# Altium project DT01.PrjPCB
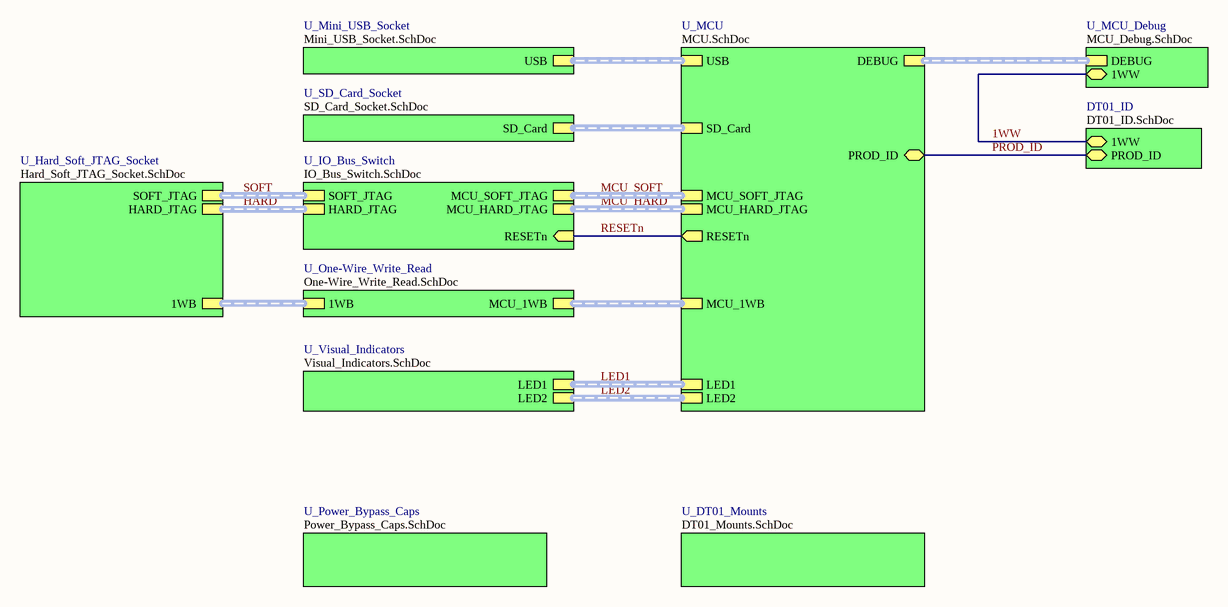
[diagram p0: DT01_Top.SchDoc]
ProjectAddress1: L3, 12A Rodborough Road; ProjectAddress2: Frenchs Forest; ProjectAddress3: NSW 2086; ProjectAddress4: Australia; ProjectAssyNum: D-820-0014; ProjectOrganization: Altium Limited; ProjectRevision: 01; ProjectTitle: DT01 - USB JTAG Interface; sheetTotal: 12
12 sheets, 94 parts. Net scope: hierarchical (ports join the sheet entries above them; power ports are global).
Board file: DT01.PcbDoc
Sheets:
  DT01_Top.SchDoc
    U_MCU = MCU.SchDoc
    DT01_ID = DT01_ID.SchDoc
    U_DT01_Mounts = DT01_Mounts.SchDoc
    U_Hard_Soft_JTAG_Socket = Hard_Soft_JTAG_Socket.SchDoc
    U_IO_Bus_Switch = IO_Bus_Switch.SchDoc
    U_Mini_USB_Socket = Mini_USB_Socket.SchDoc
    U_One-Wire_Write_Read = One-Wire_Write_Read.SchDoc
    U_Power_Bypass_Caps = Power_Bypass_Caps.SchDoc
    U_SD_Card_Socket = SD_Card_Socket.SchDoc
    U_Visual_Indicators = Visual_Indicators.SchDoc
    U_MCU_Debug = MCU_Debug.SchDoc

## Sheet DT01_Top.SchDoc: DT01 - USB JTAG Interface
size A4; Organization: Altium Limited.; Address1: Level 3, 12a Rodborough Rd; Address2: Frenchs Forest 2086; Address3: NSW; Address4: AUSTRALIA; DocumentNumber: 1; Revision: 01; SheetNumber: 1; SheetTotal: 12; PageSetup: Record=PageOptions|CenterHorizontal=True|CenterVertical=True|PrintScale=0.50|XCorrection=1.00|YCorrection=1.00|PrintKind=0|BorderSize=5000000|LeftOffset=0|BottomOffset=0|Orientation=2|PaperLength=1000|PaperWidth=1000|Scale=100|PaperSource=7|PrintQuality=600|MediaType=1|DitherType=10|PaperKind=A3 (297 x 420 mm)|PrintScaleMode=1

### Sub-sheets
DT01_ID = DT01_ID.SchDoc: PROD_ID (bidir), 1WW (bidir)
U_DT01_Mounts = DT01_Mounts.SchDoc: no entries
U_Hard_Soft_JTAG_Socket = Hard_Soft_JTAG_Socket.SchDoc: 1WB (harness 1WB_Write_Read), SOFT_JTAG (harness JTAG), HARD_JTAG (harness JTAG)
U_IO_Bus_Switch = IO_Bus_Switch.SchDoc: SOFT_JTAG (harness JTAG), HARD_JTAG (harness JTAG), MCU_SOFT_JTAG (harness JTAG), MCU_HARD_JTAG (harness JTAG), RESETn (in)
U_MCU = MCU.SchDoc: USB (harness USB), RESETn (out), DEBUG (harness LOCAL_JTAG), MCU_SOFT_JTAG (harness JTAG), MCU_HARD_JTAG (harness JTAG), MCU_1WB (harness MCU_1WB_R_W), LED1 (harness RGB_LED), LED2 (harness RGB_LED), PROD_ID (bidir), SD_Card (harness SD Card)
U_MCU_Debug = MCU_Debug.SchDoc: DEBUG (harness LOCAL_JTAG), 1WW (bidir)
U_Mini_USB_Socket = Mini_USB_Socket.SchDoc: USB (harness USB)
U_One-Wire_Write_Read = One-Wire_Write_Read.SchDoc: 1WB (harness 1WB_Write_Read), MCU_1WB (harness MCU_1WB_R_W)
U_Power_Bypass_Caps = Power_Bypass_Caps.SchDoc: no entries
U_SD_Card_Socket = SD_Card_Socket.SchDoc: SD_Card (harness SD Card)
U_Visual_Indicators = Visual_Indicators.SchDoc: LED1 (harness RGB_LED), LED2 (harness RGB_LED)

### Nets
1WW: sheet DT01_ID/1WW, sheet U_MCU_Debug/1WW
PROD_ID: sheet U_MCU/PROD_ID, sheet DT01_ID/PROD_ID
RESETn: sheet U_MCU/RESETn, sheet U_IO_Bus_Switch/RESETn

### Buses and harness runs
harness HARD = sheet U_Hard_Soft_JTAG_Socket/HARD_JTAG = sheet U_IO_Bus_Switch/HARD_JTAG
harness LED1 = sheet U_MCU/LED1 = sheet U_Visual_Indicators/LED1
harness LED2 = sheet U_MCU/LED2 = sheet U_Visual_Indicators/LED2
harness MCU_HARD = sheet U_IO_Bus_Switch/MCU_HARD_JTAG = sheet U_MCU/MCU_HARD_JTAG
harness MCU_SOFT = sheet U_IO_Bus_Switch/MCU_SOFT_JTAG = sheet U_MCU/MCU_SOFT_JTAG
harness sheet U_Hard_Soft_JTAG_Socket/1WB = sheet U_One-Wire_Write_Read/1WB
harness sheet U_MCU/DEBUG = sheet U_MCU_Debug/DEBUG
harness sheet U_MCU/MCU_1WB = sheet U_One-Wire_Write_Read/MCU_1WB
harness sheet U_MCU/SD_Card = sheet U_SD_Card_Socket/SD_Card
harness sheet U_MCU/USB = sheet U_Mini_USB_Socket/USB
harness SOFT = sheet U_Hard_Soft_JTAG_Socket/SOFT_JTAG = sheet U_IO_Bus_Switch/SOFT_JTAG

### Notes on the sheet
- Sheet Title
- Project Title
- Size:
- Date:
- A4
- Assy:
- Time:
- Revision:
- Sheet
- of
- File:

## Sheet MCU.SchDoc: MCU w/ USB & SDRAM Interface
size A2; DocumentNumber: 6; SheetNumber: 6; SheetTotal: 12
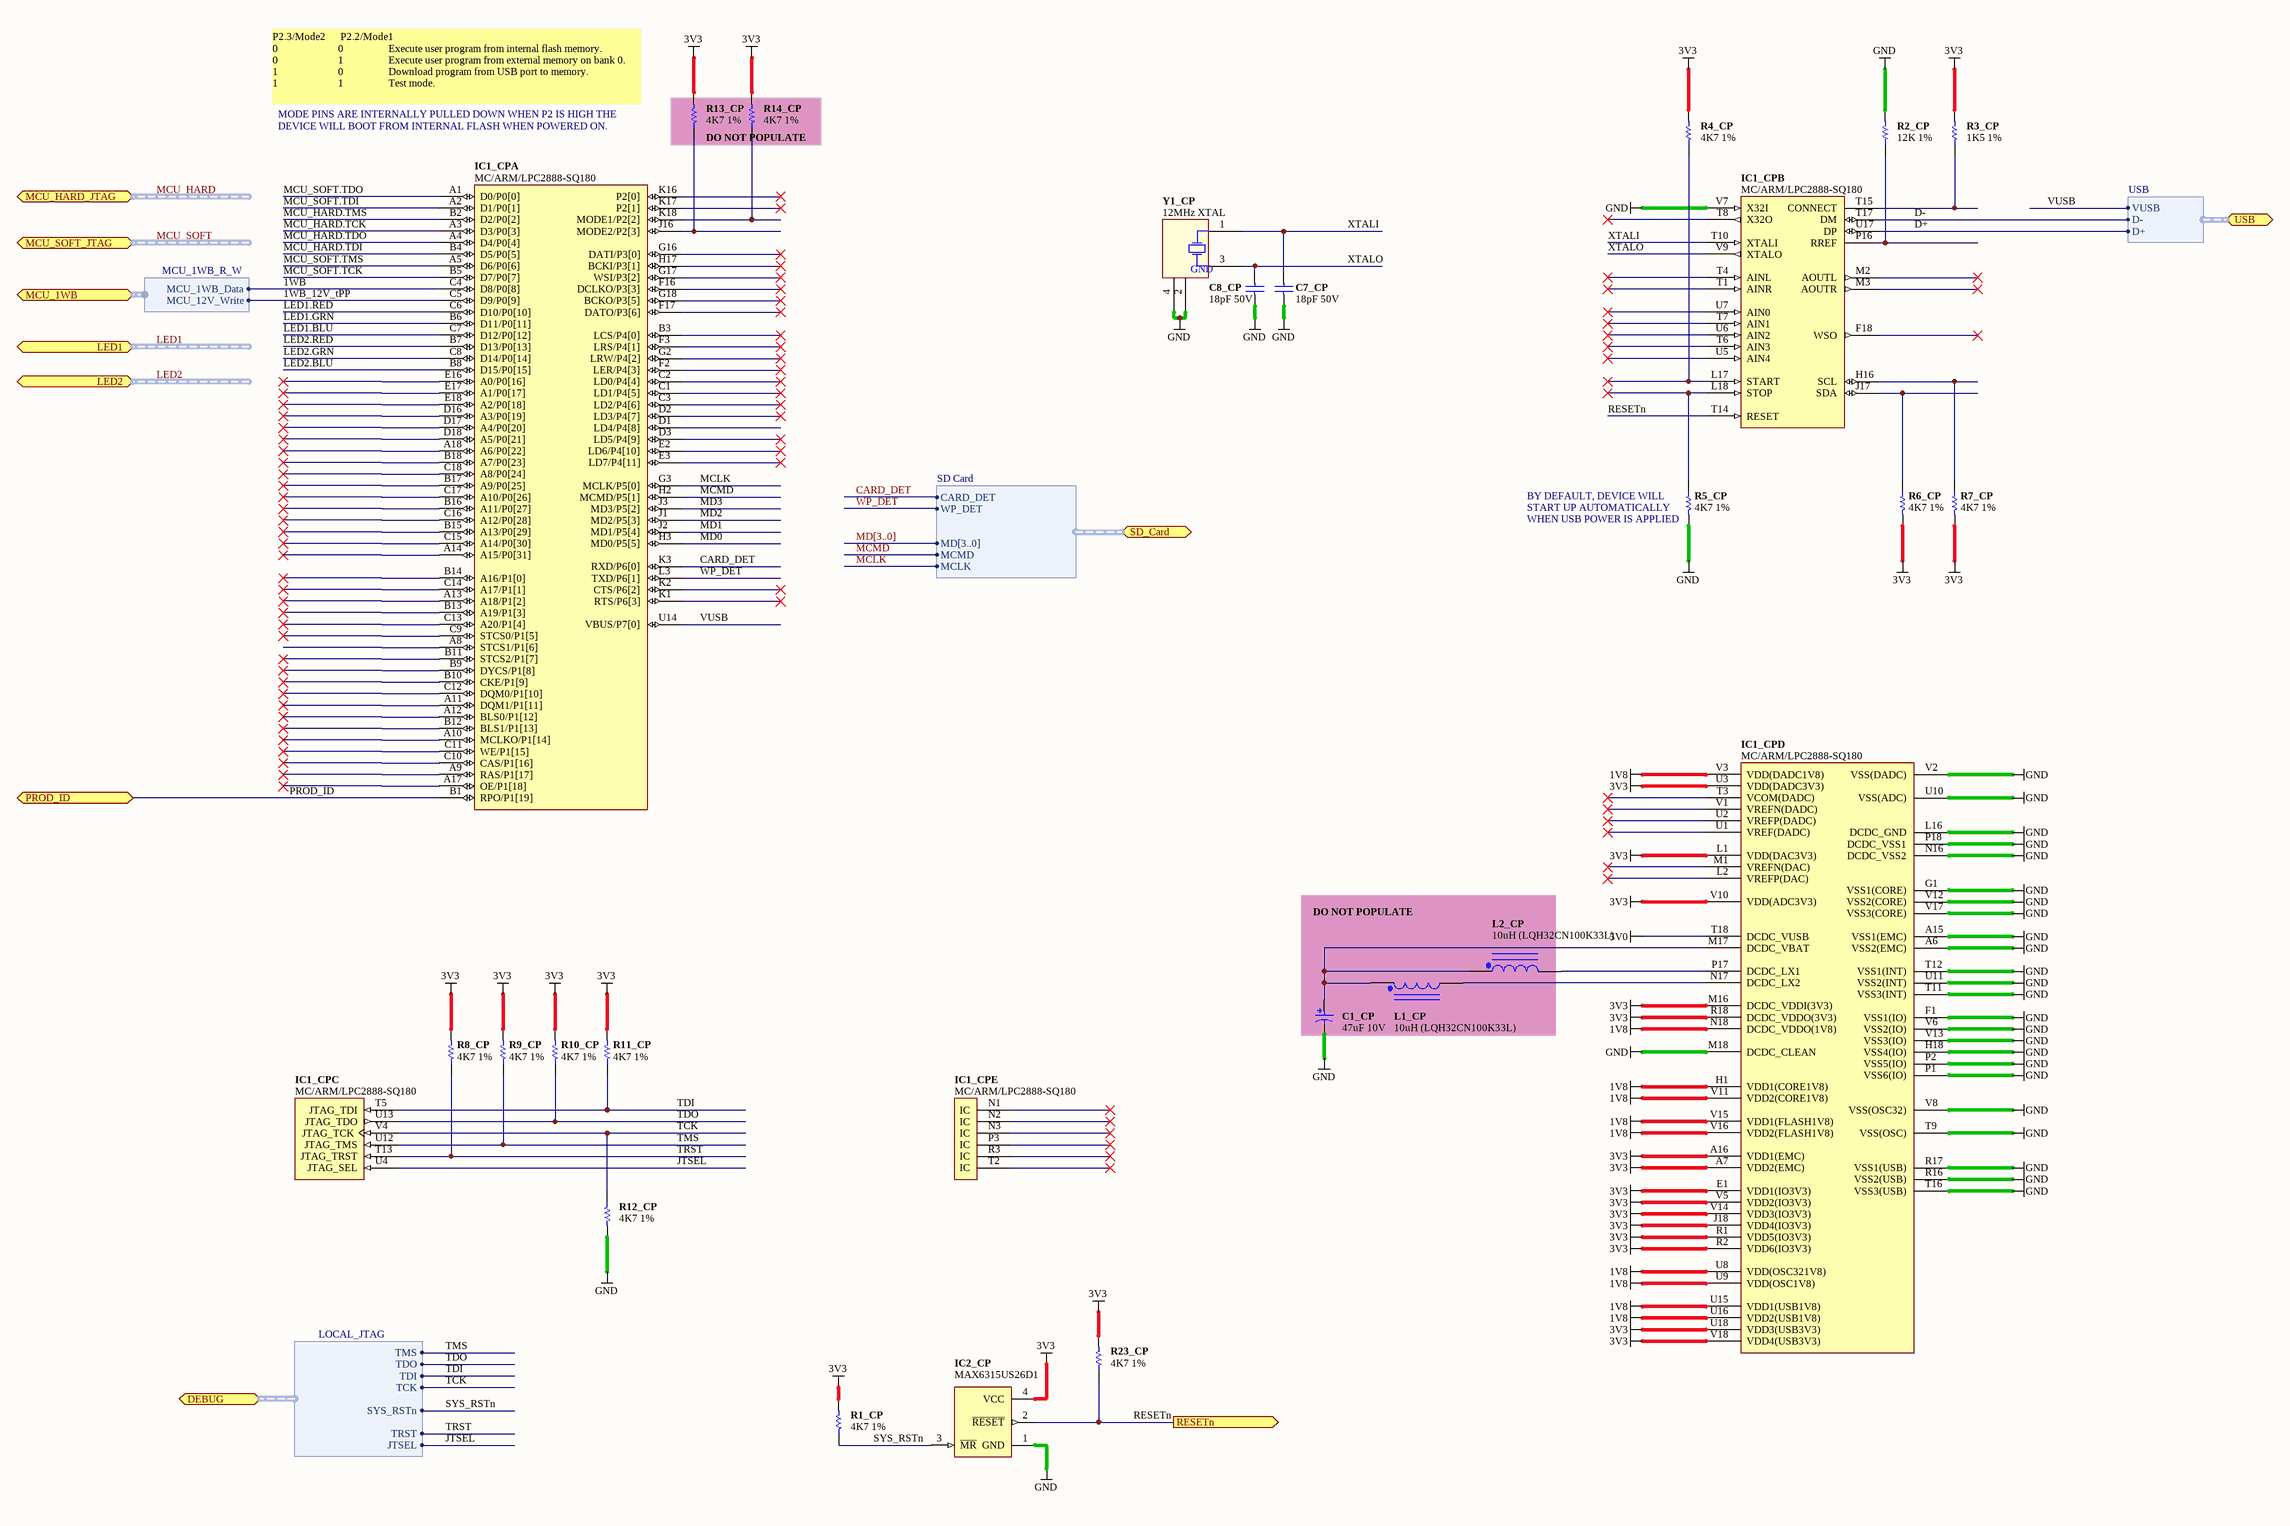
[diagram p1: MCU.SchDoc]

### Parts
C1_CP  47uF 10V  [CAPC3528-STAR]  (no BOM)
C7_CP  18pF 50V  [CAPC1005-STAR]
C8_CP  18pF 50V  [CAPC1005-STAR]
IC1_CP  MC/ARM/LPC2888-SQ180  [BGA50P18X18-180]  (parts A,B,C,D,E of 5)
IC2_CP  MAX6315US26D1  [SOT143]
L1_CP  10uH (LQH32CN100K33L)  [3261]  (no BOM)
L2_CP  10uH (LQH32CN100K33L)  [3261]  (no BOM)
R1_CP  4K7 1%  [RESC1005-STAR]
R2_CP  12K 1%  [RESC1005-STAR]
R3_CP  1K5 1%  [RESC1005-STAR]
R4_CP  4K7 1%  [RESC1005-STAR]
R5_CP  4K7 1%  [RESC1005-STAR]
R6_CP  4K7 1%  [RESC1005-STAR]
R7_CP  4K7 1%  [RESC1005-STAR]
R8_CP  4K7 1%  [RESC1005-STAR]
R9_CP  4K7 1%  [RESC1005-STAR]
R10_CP  4K7 1%  [RESC1005-STAR]
R11_CP  4K7 1%  [RESC1005-STAR]
R12_CP  4K7 1%  [RESC1005-STAR]
R13_CP  4K7 1%  [RESC1005-STAR]  (no BOM)
R14_CP  4K7 1%  [RESC1005-STAR]  (no BOM)
R23_CP  4K7 1%  [RESC1005-STAR]
Y1_CP  12MHz XTAL  [XTAL-200X126-4]

### Blocks framed on the sheet
DO NOT POPULATE: R13_CP R14_CP
DO NOT POPULATE: C1_CP L1_CP L2_CP

### Ports
DEBUG (harness LOCAL_JTAG), LED1 (harness RGB_LED), LED2 (harness RGB_LED), MCU_1WB (harness MCU_1WB_R_W), MCU_HARD_JTAG (harness JTAG), MCU_SOFT_JTAG (harness JTAG), PROD_ID (bidir), RESETn (out), SD_Card (harness SD Card), USB (harness USB)

### Harnesses
USB: VUSB, D-, D+
LOCAL_JTAG: TMS, TDO, TDI, TCK, SYS_RSTn, TRST, JTSEL
MCU_1WB_R_W: MCU_1WB_Data, MCU_12V_Write
SD Card: CARD_DET, WP_DET, MD[3..0], MCLK, MCMD

### Nets
1V8: IC1_CP.H1(VDD1(CORE1V8)) IC1_CP.N18(DCDC_VDDO(1V8)) IC1_CP.U8(VDD(OSC321V8)) IC1_CP.U9(VDD(OSC1V8)) IC1_CP.U15(VDD1(USB1V8)) IC1_CP.U16(VDD2(USB1V8)) IC1_CP.V3(VDD(DADC1V8)) IC1_CP.V11(VDD2(CORE1V8)) IC1_CP.V15(VDD1(FLASH1V8)) IC1_CP.V16(VDD2(FLASH1V8))
3V3: IC1_CP.A7(VDD2(EMC)) IC1_CP.A16(VDD1(EMC)) IC1_CP.E1(VDD1(IO3V3)) IC1_CP.J18(VDD4(IO3V3)) IC1_CP.L1(VDD(DAC3V3)) IC1_CP.M16(DCDC_VDDI(3V3)) IC1_CP.R1(VDD5(IO3V3)) IC1_CP.R2(VDD6(IO3V3)) IC1_CP.R18(DCDC_VDDO(3V3)) IC1_CP.U3(VDD(DADC3V3)) IC1_CP.U18(VDD3(USB3V3)) IC1_CP.V5(VDD2(IO3V3)) IC1_CP.V10(VDD(ADC3V3)) IC1_CP.V14(VDD3(IO3V3)) IC1_CP.V18(VDD4(USB3V3)) IC2_CP.4(VCC) R1_CP.2 R3_CP.2 R4_CP.2 R6_CP.2 R7_CP.2 R8_CP.2 R9_CP.2 R10_CP.2 R11_CP.2 R13_CP.2 R14_CP.2 R23_CP.2
5V0: IC1_CP.T18(DCDC_VUSB)
GND: C1_CP.2 C7_CP.2 C8_CP.2 IC1_CP.A6(VSS2(EMC)) IC1_CP.A15(VSS1(EMC)) IC1_CP.F1(VSS1(IO)) IC1_CP.G1(VSS1(CORE)) IC1_CP.H18(VSS4(IO)) IC1_CP.L16(DCDC_GND) IC1_CP.M18(DCDC_CLEAN) IC1_CP.N16(DCDC_VSS2) IC1_CP.P1(VSS6(IO)) IC1_CP.P2(VSS5(IO)) IC1_CP.P18(DCDC_VSS1) IC1_CP.R16(VSS2(USB)) IC1_CP.R17(VSS1(USB)) IC1_CP.T9(VSS(OSC)) IC1_CP.T11(VSS3(INT)) IC1_CP.T12(VSS1(INT)) IC1_CP.T16(VSS3(USB)) IC1_CP.U10(VSS(ADC)) IC1_CP.U11(VSS2(INT)) IC1_CP.V2(VSS(DADC)) IC1_CP.V6(VSS2(IO)) IC1_CP.V7(X32I) IC1_CP.V8(VSS(OSC32)) IC1_CP.V12(VSS2(CORE)) IC1_CP.V13(VSS3(IO)) IC1_CP.V17(VSS3(CORE)) IC2_CP.1(GND) R2_CP.2 R5_CP.2 R12_CP.2 Y1_CP.2(GND) Y1_CP.4(GND)
1WB: IC1_CP.C4(D8/P0[8]) ; port MCU_1WB.MCU_1WB_Data
1WB_12V_tPP: IC1_CP.C5(D9/P0[9]) ; port MCU_1WB.MCU_12V_Write
CARD_DET: IC1_CP.K3(RXD/P6[0]) ; port SD_Card.CARD_DET
D+: IC1_CP.U17(DP) ; port USB.D+
D-: IC1_CP.T17(DM) ; port USB.D-
JTSEL: IC1_CP.U4(JTAG_SEL) ; port DEBUG.JTSEL
LED1.BLU: IC1_CP.C7(D12/P0[12])
LED1.GRN: IC1_CP.B6(D11/P0[11])
LED1.RED: IC1_CP.C6(D10/P0[10])
LED2.BLU: IC1_CP.B8(D15/P0[15])
LED2.GRN: IC1_CP.C8(D14/P0[14])
LED2.RED: IC1_CP.B7(D13/P0[13])
MCLK: IC1_CP.G3(MCLK/P5[0]) ; port SD_Card.MCLK
MCMD: IC1_CP.H2(MCMD/P5[1]) ; port SD_Card.MCMD
MCU_HARD.TCK: IC1_CP.A3(D3/P0[3])
MCU_HARD.TDI: IC1_CP.B4(D5/P0[5])
MCU_HARD.TDO: IC1_CP.A4(D4/P0[4])
MCU_HARD.TMS: IC1_CP.B2(D2/P0[2])
MCU_SOFT.TCK: IC1_CP.B5(D7/P0[7])
MCU_SOFT.TDI: IC1_CP.A2(D1/P0[1])
MCU_SOFT.TDO: IC1_CP.A1(D0/P0[0])
MCU_SOFT.TMS: IC1_CP.A5(D6/P0[6])
MD0: IC1_CP.H3(MD0/P5[5])
MD1: IC1_CP.J2(MD1/P5[4])
MD2: IC1_CP.J1(MD2/P5[3])
MD3: IC1_CP.J3(MD3/P5[2])
PROD_ID: IC1_CP.B1(RPO/P1[19]) ; port PROD_ID
RESETn: IC1_CP.T14(RESET) IC2_CP.2(~{RESET}) R23_CP.1 ; port RESETn
SYS_RSTn: IC2_CP.3(~{MR}) R1_CP.1 ; port DEBUG.SYS_RSTn
TCK: IC1_CP.V4(JTAG_TCK) R12_CP.1 ; port DEBUG.TCK
TDI: IC1_CP.T5(JTAG_TDI) R11_CP.1 ; port DEBUG.TDI
TDO: IC1_CP.U13(JTAG_TDO) R10_CP.1 ; port DEBUG.TDO
TMS: IC1_CP.U12(JTAG_TMS) R9_CP.1 ; port DEBUG.TMS
TRST: IC1_CP.T13(JTAG_TRST) R8_CP.1 ; port DEBUG.TRST
VUSB: IC1_CP.U14(VBUS/P7[0]) ; port USB.VUSB
WP_DET: IC1_CP.L3(TXD/P6[1]) ; port SD_Card.WP_DET
XTALI: C7_CP.1 IC1_CP.T10(XTALI) Y1_CP.1(X1)
XTALO: C8_CP.1 IC1_CP.V9(XTALO) Y1_CP.3(X2)
NetC1_CP_1: C1_CP.1 IC1_CP.M17(DCDC_VBAT) L1_CP.1 L2_CP.1
NetIC1_CP_H16: IC1_CP.H16(SCL) R7_CP.1
NetIC1_CP_J16: IC1_CP.J16(MODE2/P2[3]) R13_CP.1
NetIC1_CP_J17: IC1_CP.J17(SDA) R6_CP.1
NetIC1_CP_K18: IC1_CP.K18(MODE1/P2[2]) R14_CP.1
NetIC1_CP_L17: IC1_CP.L17(START) R4_CP.1
NetIC1_CP_L18: IC1_CP.L18(STOP) R5_CP.1
NetIC1_CP_N17: IC1_CP.N17(DCDC_LX2) L1_CP.2
NetIC1_CP_P16: IC1_CP.P16(RREF) R2_CP.1
NetIC1_CP_P17: IC1_CP.P17(DCDC_LX1) L2_CP.2
NetIC1_CP_T15: IC1_CP.T15(CONNECT) R3_CP.1

Not connected (* = marked no-connect by the designer): IC1_CP A8(STCS1/P1[6]) A9(RAS/P1[17])* A10(MCLKO/P1[14])* A11(DQM1/P1[11])* A12(BLS0/P1[12])* A13(A18/P1[2])* A14(A15/P0[31])* A17(OE/P1[18])* A18(A6/P0[22])* B3(LCS/P4[0])* B9(DYCS/P1[8])* B10(CKE/P1[9])* B11(STCS2/P1[7])* B12(BLS1/P1[13])* B13(A19/P1[3])* B14(A16/P1[0])* B15(A13/P0[29])* B16(A11/P0[27])* B17(A9/P0[25])* B18(A7/P0[23])* C1(LD1/P4[5])* C2(LD0/P4[4])* C3(LD2/P4[6])* C9(STCS0/P1[5])* C10(CAS/P1[16])* C11(WE/P1[15])* C12(DQM0/P1[10])* C13(A20/P1[4])* C14(A17/P1[1])* C15(A14/P0[30])* C16(A12/P0[28])* C17(A10/P0[26])* C18(A8/P0[24])* D1(LD4/P4[8]) D2(LD3/P4[7])* D3(LD5/P4[9])* D16(A3/P0[19])* D17(A4/P0[20])* D18(A5/P0[21])* E2(LD6/P4[10])* E3(LD7/P4[11])* E16(A0/P0[16])* E17(A1/P0[17])* E18(A2/P0[18])* F2(LER/P4[3])* F3(LRS/P4[1])* F16(DCLKO/P3[3])* F17(DATO/P3[6])* F18(WSO)* G2(LRW/P4[2])* G16(DATI/P3[0])* G17(WSI/P3[2])* G18(BCKO/P3[5])* H17(BCKI/P3[1])* K1(RTS/P6[3])* K2(CTS/P6[2])* K16(P2[0])* K17(P2[1])* L2(VREFP(DAC))* M1(VREFN(DAC))* M2(AOUTL)* M3(AOUTR)* N1(IC)* N2(IC)* N3(IC)* P3(IC)* R3(IC)* T1(AINR)* T2(IC)* T3(VCOM(DADC))* T4(AINL)* T6(AIN3)* T7(AIN1)* T8(X32O)* U1(VREF(DADC))* U2(VREFP(DADC))* U5(AIN4)* U6(AIN2)* U7(AIN0)* V1(VREFN(DADC))*

### Buses and harness runs
bus MD[3..0]
harness LED1 = port LED1
harness LED2 = port LED2
harness MCU_HARD = port MCU_HARD_JTAG
harness MCU_SOFT = port MCU_SOFT_JTAG

### Notes on the sheet
- P2.3/Mode2      P2.2/Mode1
  0                        0                  Execute user program from internal flash memory.
  0                        1                  Execute user program from external memory on bank 0.
  1                        0                  Download program from USB port to memory.
  1                        1                  Test mode.
- MODE PINS ARE INTERNALLY PULLED DOWN WHEN P2 IS HIGH THE
- DEVICE WILL BOOT FROM INTERNAL FLASH WHEN POWERED ON.
- (near R5_CP) BY DEFAULT, DEVICE WILL
- START UP AUTOMATICALLY
- (near R5_CP) WHEN USB POWER IS APPLIED
- Project Title
- Sheet Title
- Size:
- Date:
- File:
- A2
- Assy:
- Time:
- Revision:
- Sheet
- of

### Library data of the parts
C1_CP = D-101-0001: Capacitor, Tantalum, 47uF 20% 10V MCCT-B (3528-12); Polarity: Polarized; Category: Capacitor; Capacitance: 47 uF; Mounting Technology: Surface Mount; Rated Voltage: 10 V; Status: Deprecated; Technology: Tantalum; Tolerance: 20 %
C7_CP C8_CP = D-101-0089: Capacitor, Ceramic, 18pF 5% 50V 0402 (1005) COG; Polarity: Non-Polarized; Rated Voltage: 50 mV; Category: Capacitor; Capacitance: 18 pF; Dielectric: COG; Mounting Technology: Surface Mount; Status: Unreleased; Technology: Ceramic; Tolerance: 5 %
IC1_CP = D-242-0001: 16/32-bit ARM microcontrollers; 8 kB cache, up to 1 MB flash,  High Speed USB 2.0 device, and SDRAM memory interface; Bit Width: Bits; Max Clock Frequency: Hz; Supply Voltage: mV; Mounting Technology: Surface Mount; Status: Unreleased; Category: IC-MCU
IC2_CP = D-243-0000: MAX6315, Open-Drain Output SOT Reset IC, Customized Reset Thresholds, Timeout Delays; Category: IC-Other; Status: Production
L1_CP L2_CP = D-102-0011: Inductor, 10uH, 450mA, 0.3R, 1210 (3225) LQH32CN100K33L; Category: Inductor; Inductance: 10 uH; Max Input Current: 450 mA; Mounting Technology: Surface Mount; Status: Production
R1_CP R4_CP R5_CP R6_CP R7_CP R8_CP R9_CP R10_CP R11_CP R12_CP R13_CP R14_CP R23_CP = D-100-0088: Resistor, 4K7 1% 0402 (1005); Power Rating: 63 mW; Resistance: 4.7 K; Category: Resistor; Mounting Technology: Surface Mount; Status: Production; Tolerance: 1 %
R2_CP = D-100-0002: Resistor, 12K 1% 0402; Power Rating: mW; Resistance: mR; Tolerance: %; Category: Resistor; Mounting Technology: Surface Mount; Status: Unreleased
R3_CP = D-100-0003: Resistor, 1K5 1% 0402; Power Rating: mW; Resistance: mR; Tolerance: %; Category: Resistor; Mounting Technology: Surface Mount; Status: Unreleased
Y1_CP = D-103-0029: Crystal, SMD, 12.000000MHz Stab=50ppm 10.0pF; Frequency Stability: 50 ppm; Load Capacitance: 10 pF; Nominal Operational Voltage: mV; Category: Crystal; Frequency Tolerance: 50 ppm; Mounting Technology: Surface Mount; Nominal Fequency: 12 MHz; Status: Production

## Sheet DT01_ID.SchDoc: DT01 Identification
size A4; DocumentNumber: 2; SheetNumber: 2; SheetTotal: 12
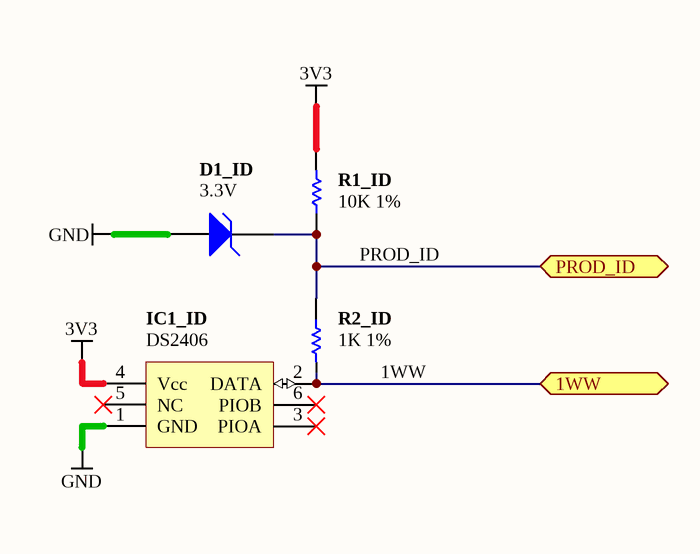
[diagram p2: DT01_ID.SchDoc]

### Parts
D1_ID  3.3V  [SOT95P230-3D]
IC1_ID  DS2406  [TSOC6]
R1_ID  10K 1%  [RESC1005-STAR]
R2_ID  1K 1%  [RESC1005-STAR]

### Ports
1WW (bidir), PROD_ID (bidir)

### Nets
3V3: IC1_ID.4(Vcc) R1_ID.2
GND: D1_ID.1(A) IC1_ID.1(GND)
1WW: IC1_ID.2(DATA) R2_ID.2 ; port 1WW
PROD_ID: D1_ID.2(K) R1_ID.1 R2_ID.1 ; port PROD_ID

Not connected (* = marked no-connect by the designer): IC1_ID 3(PIOA)* 5(NC)* 6(PIOB)*

### Notes on the sheet
- Sheet Title
- Project Title
- Size:
- Date:
- A4
- Assy:
- Time:
- Revision:
- Sheet
- of
- File:

### Library data of the parts
D1_ID = D-150-0005: Zener Diode, 3.3V; Max Forward Current: mA; Mounting Technology: Surface Mount; Rated Voltage: 3.3 V; Status: Production; Category: Diode-Zener
IC1_ID = D-263-0002: Dual Addressable Switch Plus 1KB Memory; Bit Length: Bits; Speed: ps; Supply Voltage: mV; Bit Width: Bits; Mounting Technology: Surface Mount; Status: Unreleased; Technology: None; Category: IC-PROM
R1_ID = D-100-0130: Resistor, 10K 1% 0402 (1005); Power Rating: 63 mW; Category: Resistor; Mounting Technology: Surface Mount; Resistance: 10 K; Status: Production; Tolerance: 1 %
R2_ID = D-100-0121: Resistor, 1K 1% 0402 (1005); Power Rating: 63 mW; Category: Resistor; Mounting Technology: Surface Mount; Resistance: 1 K; Status: Production; Tolerance: 1 %

## Sheet DT01_Mounts.SchDoc: DT01 Mounts
size A4; DocumentNumber: 3; SheetNumber: 3; SheetTotal: 12
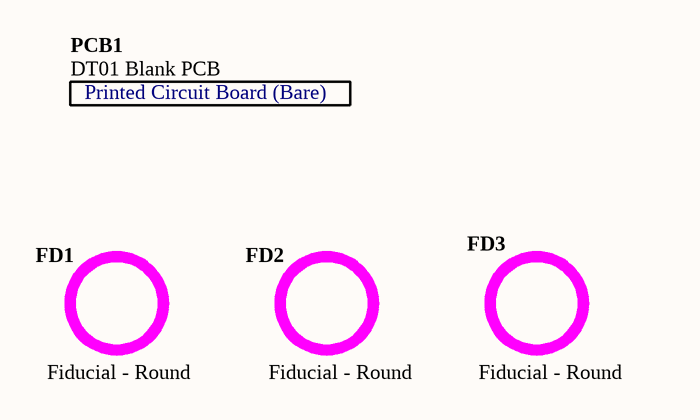
[diagram p3: DT01_Mounts.SchDoc]

### Parts
FD1  Fiducial - Round  [FIDUCIAL 2]
FD2  Fiducial - Round  [FIDUCIAL 2]
FD3  Fiducial - Round  [FIDUCIAL 2]
PCB1  DT01 Blank PCB

### Notes on the sheet
- Sheet Title
- Project Title
- Size:
- Date:
- A4
- Assy:
- Time:
- Revision:
- Sheet
- of
- File:
- (in symbol D-810-0014) Printed Circuit Board (Bare)

### Library data of the parts
FD1-FD3 = D-004-0001: Fiducial - Round 1.5mm Top-Bottom; Status: Unreleased; Category: Fiducial
PCB1 = D-810-0014: DT01 Blank PCB - USB JTAG Adaptor with SD Card and 1-Wire; ProjectPath: DT01.PrjPCB; Status: Unreleased; Category: Blank PCB

## Sheet Hard_Soft_JTAG_Socket.SchDoc: Hard & Soft JTAG Socket
size A4; DocumentNumber: 4; SheetNumber: 4; SheetTotal: 12
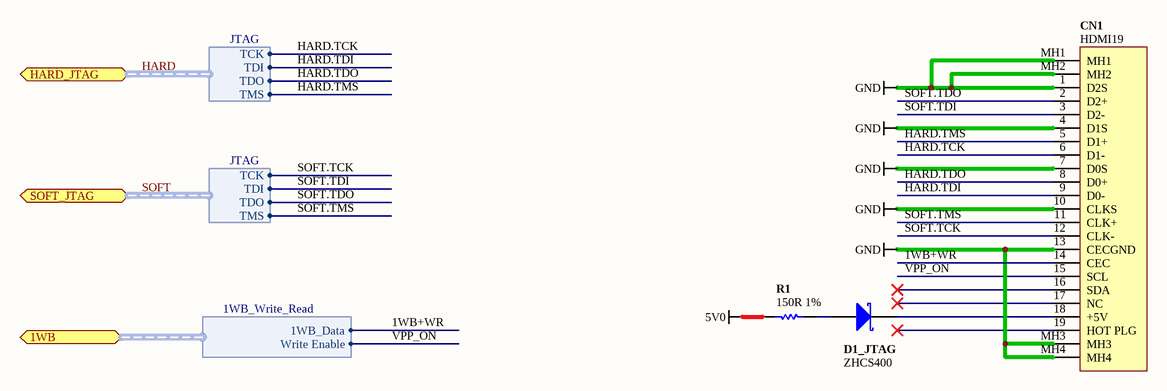
[diagram p4: Hard_Soft_JTAG_Socket.SchDoc]

### Parts
CN1  HDMI19  [G3168-0500XXXX-00]
D1_JTAG  ZHCS400  [SOD323]
R1  150R 1%  [RESC1005-STAR]

### Ports
1WB (harness 1WB_Write_Read), HARD_JTAG (harness JTAG), SOFT_JTAG (harness JTAG)

### Harnesses
1WB_Write_Read: 1WB_Data, Write Enable
JTAG: TCK, TDI, TDO, TMS

### Nets
5V0: R1.1
GND: CN1.1(D2S) CN1.4(D1S) CN1.7(D0S) CN1.10(CLKS) CN1.13(CECGND) CN1.MH1 CN1.MH2 CN1.MH3 CN1.MH4
1WB+WR: CN1.14(CEC) ; port 1WB.1WB_Data
HARD.TCK: CN1.6(D1-) ; port HARD_JTAG.TCK
HARD.TDI: CN1.9(D0-) ; port HARD_JTAG.TDI
HARD.TDO: CN1.8(D0+) ; port HARD_JTAG.TDO
HARD.TMS: CN1.5(D1+) ; port HARD_JTAG.TMS
SOFT.TCK: CN1.12(CLK-) ; port SOFT_JTAG.TCK
SOFT.TDI: CN1.3(D2-) ; port SOFT_JTAG.TDI
SOFT.TDO: CN1.2(D2+) ; port SOFT_JTAG.TDO
SOFT.TMS: CN1.11(CLK+) ; port SOFT_JTAG.TMS
VPP_ON: CN1.15(SCL) ; port 1WB.Write Enable
NetCN1_18: CN1.18(+5V) D1_JTAG.2(K)
NetD1_JTAG_1: D1_JTAG.1(A) R1.2

Not connected (* = marked no-connect by the designer): CN1 16(SDA)* 17(NC)* 19(HOT_PLG)*

### Buses and harness runs
harness HARD = port HARD_JTAG
harness SOFT = port SOFT_JTAG

### Notes on the sheet
- Sheet Title
- Project Title
- Size:
- Date:
- A4
- Assy:
- Time:
- Revision:
- Sheet
- of
- File:

### Library data of the parts
CN1 = D-300-0058: HDMI Socket; 19 Pin; Connector type: Right Angle; Max Current: mA; Category: Connector; Mounting Technology: Surface Mount; Status: Unreleased
D1_JTAG = D-151-0004: Schottky Diode, 400mA; Rated Voltage: mV; Category: Diode-Schottky; Max Forward Current: 400 mA; Mounting Technology: Surface Mount; Status: Unreleased
R1 = D-100-0005: Resistor, 150R 1% 0402 (1005); Power Rating: 63 mW; Category: Resistor; Mounting Technology: Surface Mount; Resistance: 150 R; Status: Unreleased; Tolerance: 1 %

## Sheet IO_Bus_Switch.SchDoc: IO Bus Switch
size A4; DocumentNumber: 5; SheetNumber: 5; SheetTotal: 12
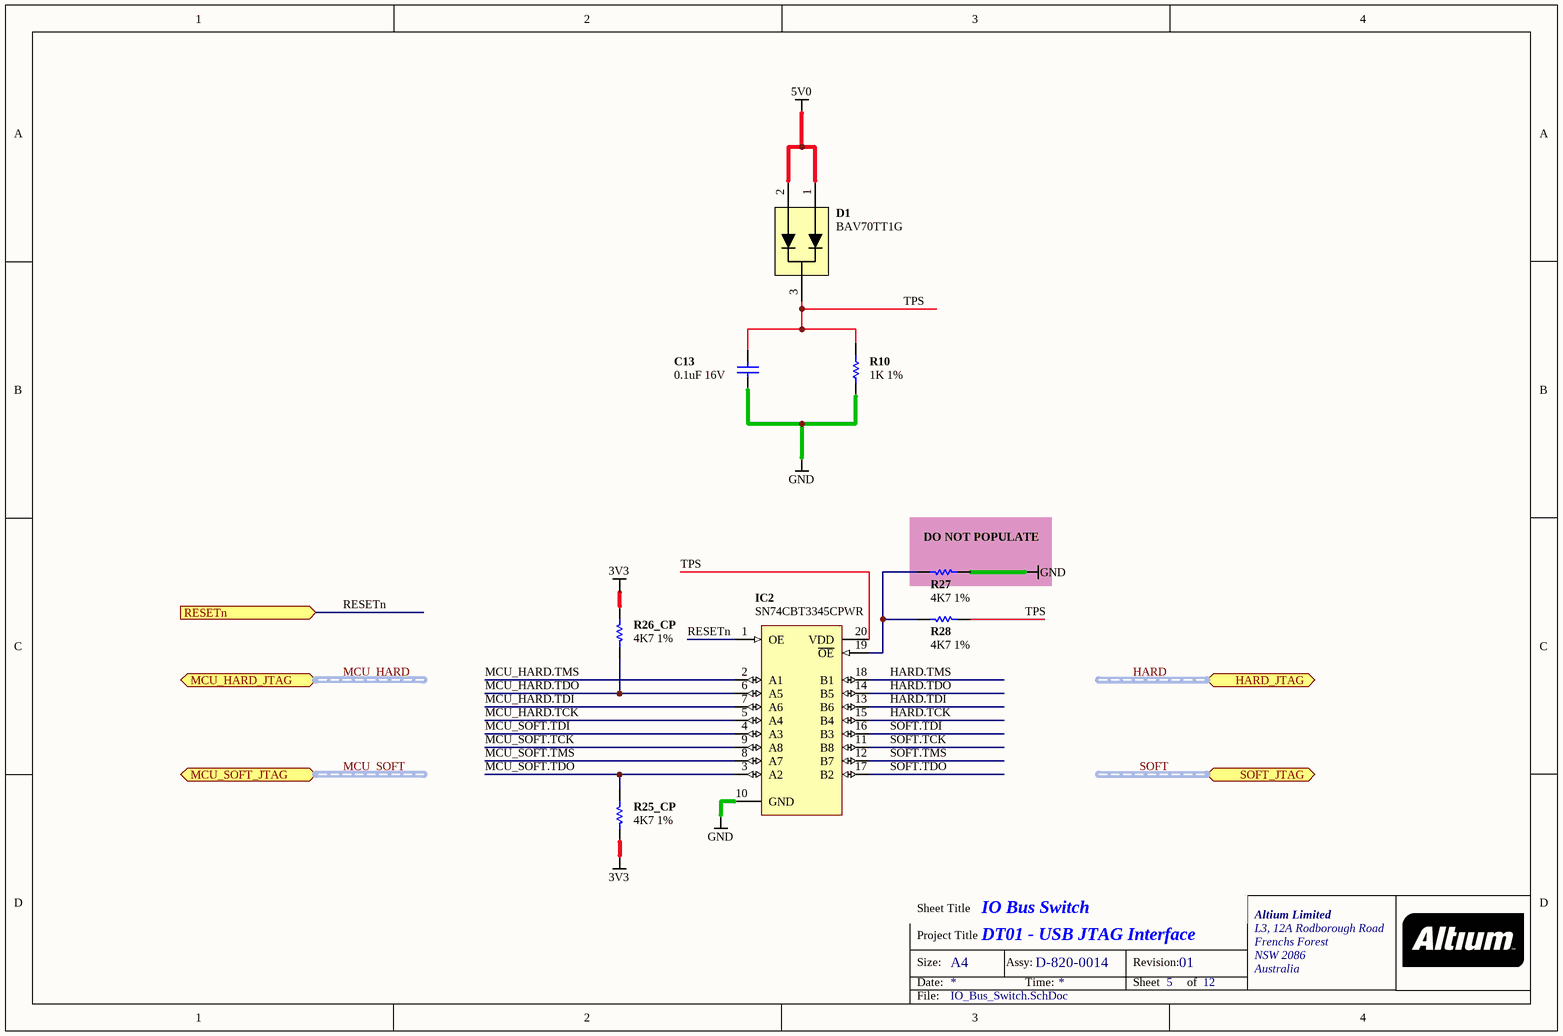
[diagram p5: IO_Bus_Switch.SchDoc]

### Parts
C13  0.1uF 16V  [CAPC1005-STAR]
D1  BAV70TT1G  [SOT95P230-3]
IC2  SN74CBT3345CPWR  [TSOP65P650-20]
R10  1K 1%  [RESC1005-STAR]
R25_CP  4K7 1%  [RESC1005-STAR]
R26_CP  4K7 1%  [RESC1005-STAR]
R27  4K7 1%  [RESC1005-STAR]  (no BOM)
R28  4K7 1%  [RESC1005-STAR]

### Blocks framed on the sheet
DO NOT POPULATE: R27

### Ports
HARD_JTAG (harness JTAG), MCU_HARD_JTAG (harness JTAG), MCU_SOFT_JTAG (harness JTAG), RESETn (in), SOFT_JTAG (harness JTAG)

### Nets
3V3: R25_CP.2 R26_CP.2
5V0: D1.1 D1.2
GND: C13.2 IC2.10(GND) R10.2 R27.1
HARD.TCK: IC2.15(B4)
HARD.TDI: IC2.13(B6)
HARD.TDO: IC2.14(B5)
HARD.TMS: IC2.18(B1)
MCU_HARD.TCK: IC2.5(A4)
MCU_HARD.TDI: IC2.7(A6)
MCU_HARD.TDO: IC2.6(A5) R26_CP.1
MCU_HARD.TMS: IC2.2(A1)
MCU_SOFT.TCK: IC2.9(A8)
MCU_SOFT.TDI: IC2.4(A3)
MCU_SOFT.TDO: IC2.3(A2) R25_CP.1
MCU_SOFT.TMS: IC2.8(A7)
RESETn: IC2.1(OE) ; port RESETn
SOFT.TCK: IC2.11(B8)
SOFT.TDI: IC2.16(B3)
SOFT.TDO: IC2.17(B2)
SOFT.TMS: IC2.12(B7)
TPS: C13.1 D1.3 IC2.20(VDD) R10.1 R28.1
NetIC2_19: IC2.19(~{OE}) R27.2 R28.2

### Buses and harness runs
harness HARD = port HARD_JTAG
harness MCU_HARD = port MCU_HARD_JTAG
harness MCU_SOFT = port MCU_SOFT_JTAG
harness SOFT = port SOFT_JTAG

### Notes on the sheet
- Sheet Title
- Project Title
- Size:
- Date:
- A4
- Assy:
- Time:
- Revision:
- Sheet
- of
- File:

### Library data of the parts
C13 = D-101-0080: Capacitor, Ceramic, 0.1uF 10% 16V 0402 (1005) X7R; Polarity: Non-Polarized; Capacitance: 0.1 uF; Category: Capacitor; Dielectric: X7R; Mounting Technology: Surface Mount; Rated Voltage: 16 V; Status: Production; Technology: Ceramic; Tolerance: 10 %
D1 = D-155-0000: Dual Switching Diode; Max Forward Current: 200 mA; Rated Voltage: 70 V; Mounting Technology: Surface Mount; Status: Production; Category: Signal Diode
IC2 = D-205-0005: SN74CBT3345CPWR; HIGH SPEED 8-BIT BUS SWITCH; Mounting Technology: Surface Mount; Status: Production; Category: IC-Logic
R10 = D-100-0121: as R2_ID on sheet DT01_ID; Category: Resistor; Mounting Technology: Surface Mount; Resistance: 1 K; Status: Production; Tolerance: 1 %
R25_CP R26_CP R27 R28 = D-100-0088: as R1_CP on sheet MCU; Category: Resistor; Mounting Technology: Surface Mount; Status: Production; Tolerance: 1 %

## Sheet Mini_USB_Socket.SchDoc: Mini-USB Socket
size A4; DocumentNumber: 8; SheetNumber: 8; SheetTotal: 12
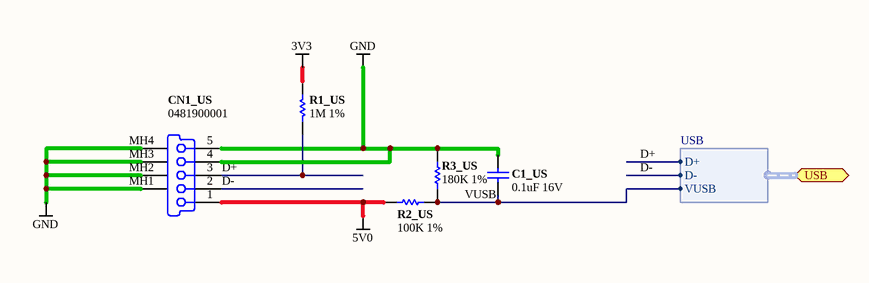
[diagram p6: Mini_USB_Socket.SchDoc]

### Parts
C1_US  0.1uF 16V  [CAPC1005-STAR]
CN1_US  0481900001  [481900001]
R1_US  1M 1%  [RESC1005-STAR]
R2_US  100K 1%  [RESC1005-STAR]
R3_US  180K 1%  [RESC1005-STAR]

### Ports
USB (harness USB)

### Harnesses
USB: VUSB, D-, D+

### Nets
3V3: R1_US.2
5V0: CN1_US.1 R2_US.2
GND: C1_US.1 CN1_US.4 CN1_US.5 CN1_US.MH1 CN1_US.MH2 CN1_US.MH3 CN1_US.MH4 R3_US.2
D+: CN1_US.3 R1_US.1 ; port USB.D+
D-: CN1_US.2 ; port USB.D-
VUSB: C1_US.2 R2_US.1 R3_US.1 ; port USB.VUSB

### Notes on the sheet
- Sheet Title
- Project Title
- Size:
- Date:
- A4
- Assy:
- Time:
- Revision:
- Sheet
- of
- File:

### Library data of the parts
C1_US = D-101-0080: as C13 on sheet IO_Bus_Switch; Category: Capacitor; Capacitance: 0.1 uF; Dielectric: X7R; Mounting Technology: Surface Mount; Rated Voltage: 16 V; Status: Production; Technology: Ceramic; Tolerance: 10 %
CN1_US = D-300-0034: USB On-The-Go (OTG) Mini-B Receptacle, Right Angle, SMT, 0.80mm (.031") Pitch, Solder Tabs with Back Cover, Recessed Type; Max Current: mA; Connector type: Right Angle; Mounting Technology: Surface Mount; Status: Unreleased; Category: Connector
R1_US = D-100-0075: Resistor, 1M 1% 0402; Power Rating: mW; Resistance: mR; Tolerance: %; Category: Resistor; Mounting Technology: Surface Mount; Status: Unreleased
R2_US = D-100-0132: Resistor, 100K 1% 0402 (1005); Power Rating: 63 mW; Category: Resistor; Mounting Technology: Surface Mount; Resistance: 100 K; Status: Production; Tolerance: 1 %
R3_US = D-100-0006: Resistor, 180K 1% 0402 (1005); Power Rating: 63 mW; Tolerance: %; Category: Resistor; Mounting Technology: Surface Mount; Resistance: 180 K; Status: Unreleased

## Sheet One-Wire_Write_Read.SchDoc: One-Wire Write/Read
size A4; DocumentNumber: 9; SheetNumber: 9; SheetTotal: 12
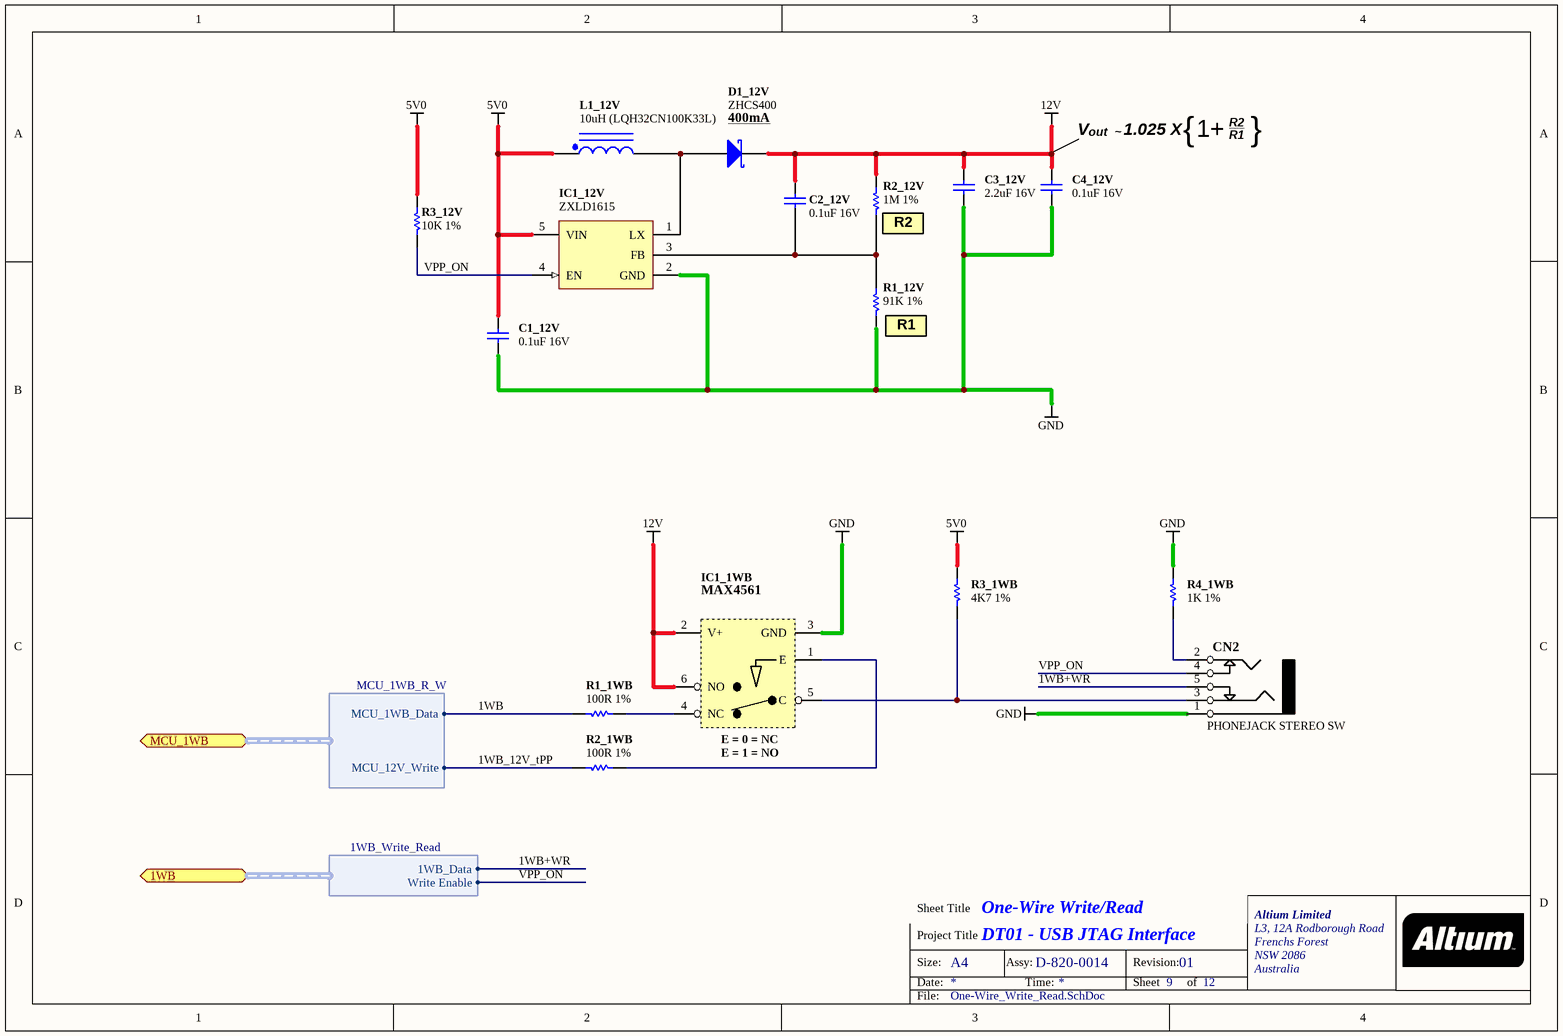
[diagram p7: One-Wire_Write_Read.SchDoc]

### Parts
C1_12V  0.1uF 16V  [CAPC1005-STAR]
C2_12V  0.1uF 16V  [CAPC1005-STAR]
C3_12V  2.2uF 16V  [CAPC2012-STAR]
C4_12V  0.1uF 16V  [CAPC1005-STAR]
CN2  PHONEJACK STEREO SW  [STX-2550-5N-TR]
D1_12V  ZHCS400  [SOD323]
IC1_1WB  MAX4561  [SOT23-6]
IC1_12V  ZXLD1615  [SOT-23-5]
L1_12V  10uH (LQH32CN100K33L)  [3261]
R1_1WB  100R 1%  [RESC1005-STAR]
R1_12V  91K 1%  [RESC1005-STAR]
R2_1WB  100R 1%  [RESC1005-STAR]
R2_12V  1M 1%  [RESC1005-STAR]
R3_1WB  4K7 1%  [RESC1005-STAR]
R3_12V  10K 1%  [RESC1005-STAR]
R4_1WB  1K 1%  [RESC1005-STAR]

### Ports
1WB (harness 1WB_Write_Read), MCU_1WB (harness MCU_1WB_R_W)

### Harnesses
1WB_Write_Read: 1WB_Data, Write Enable
MCU_1WB_R_W: MCU_1WB_Data, MCU_12V_Write

### Nets
5V0: C1_12V.2 IC1_12V.5(VIN) L1_12V.1 R3_1WB.2 R3_12V.1
12V: C2_12V.2 C3_12V.2 C4_12V.2 D1_12V.2(K) IC1_1WB.2(V+) IC1_1WB.6(NO) R2_12V.2
GND: C1_12V.1 C3_12V.1 C4_12V.1 CN2.1 IC1_1WB.3(GND) IC1_12V.2(GND) R1_12V.1 R4_1WB.2
1WB: R1_1WB.1 ; port MCU_1WB.MCU_1WB_Data
1WB+WR: CN2.5 ; port 1WB.1WB_Data
1WB_12V_tPP: R2_1WB.1 ; port MCU_1WB.MCU_12V_Write
VPP_ON: CN2.4 IC1_12V.4(EN) R3_12V.2 ; port 1WB.Write Enable
NetC2_12V_1: C2_12V.1 IC1_12V.3(FB) R1_12V.2 R2_12V.1
NetCN2_2: CN2.2 R4_1WB.1
NetCN2_3: CN2.3 IC1_1WB.5(C) R3_1WB.1
NetD1_12V_1: D1_12V.1(A) IC1_12V.1(LX) L1_12V.2
NetIC1_1WB_1: IC1_1WB.1(E) R2_1WB.2
NetIC1_1WB_4: IC1_1WB.4(NC) R1_1WB.2

### Notes on the sheet
- (near D1_12V) 400mA
- (near C4_12V) V
- out  ~
- 1.025 X
- {
- 1+
- R2
- R1
- }
- (near R2_12V) R2
- (near R1_12V) R1
- (near IC1_1WB) E = 0 = NC
- (near IC1_1WB) E = 1 = NO
- Sheet Title
- Project Title
- Size:
- Date:
- A4
- Assy:
- Time:
- Revision:
- Sheet
- of
- File:

### Library data of the parts
C1_12V C2_12V C4_12V = D-101-0080: as C13 on sheet IO_Bus_Switch; Capacitance: 0.1 uF; Dielectric: X7R; Mounting Technology: Surface Mount; Rated Voltage: 16 V; Status: Production; Technology: Ceramic; Tolerance: 10 %; Category: Capacitor
C3_12V = D-101-0000: Capacitor, Ceramic, 2.2uF 10% 16V 0805 (2012) X5R; Polarity: Non-Polarized; Capacitance: 2.2 uF; Dielectric: X5R; Mounting Technology: Surface Mount; Rated Voltage: 16 V; Status: Unreleased; Technology: Ceramic; Tolerance: 10 %; Category: Capacitor
CN2 = D-300-0059: Connector type: Header; Max Current: mA; Mounting Technology: Surface Mount; Status: Unreleased; Category: Connector
D1_12V = D-151-0004: Schottky Diode, 400mA; Rated Voltage: mV; Category: Diode-Schottky; Max Forward Current: 400 mA; Mounting Technology: Surface Mount; Status: Unreleased
IC1_1WB = D-200-0003: ±15kV ESD-Protected, Low-Voltage,  SPDT, CMOS Analog Switches; Supply Voltage: mV; Mounting Technology: Surface Mount; Status: Unreleased; Category: IC-Analog
IC1_12V = D-204-0017: ADJUSTABLE DC-DC BOOST CONVERTER WITH INTERNAL SWITCH IN  TSOT23-5; Max Input Voltage: 5.5 V; Max Output Current: 250 mA; Max Output Voltage: 28 V; Min Input Voltage: mV; Min Output Voltage: mV; Mounting Technology: Surface Mount; Status: Unreleased; Supply Voltage: mV; Category: IC-Power
L1_12V = D-102-0011: as L1_CP on sheet MCU; Category: Inductor; Inductance: 10 uH; Max Input Current: 450 mA; Mounting Technology: Surface Mount; Status: Production
R1_1WB R2_1WB = D-100-0131: Resistor, 100R 1% 0402 (1005); Power Rating: 63 mW; Category: Resistor; Mounting Technology: Surface Mount; Resistance: 100 R; Status: Production; Tolerance: 1 %
R1_12V = D-100-0073: Resistor, 91K 1% 0402; Power Rating: mW; Resistance: mR; Tolerance: %; Category: Resistor; Mounting Technology: Surface Mount; Status: Unreleased
R2_12V = D-100-0075: as R1_US on sheet Mini_USB_Socket; Category: Resistor; Mounting Technology: Surface Mount; Status: Unreleased
R3_1WB = D-100-0088: as R1_CP on sheet MCU; Category: Resistor; Mounting Technology: Surface Mount; Status: Production; Tolerance: 1 %
R3_12V = D-100-0130: as R1_ID on sheet DT01_ID; Category: Resistor; Mounting Technology: Surface Mount; Resistance: 10 K; Status: Production; Tolerance: 1 %
R4_1WB = D-100-0121: as R2_ID on sheet DT01_ID; Category: Resistor; Mounting Technology: Surface Mount; Resistance: 1 K; Status: Production; Tolerance: 1 %

## Sheet Power_Bypass_Caps.SchDoc: Power Supply Bypass Capacitors
size A4; DocumentNumber: 10; SheetNumber: 10; SheetTotal: 12
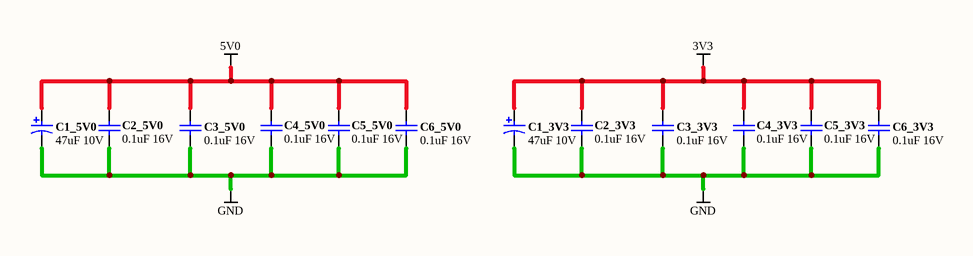
[diagram p8: Power_Bypass_Caps.SchDoc]

### Parts
C1_3V3  47uF 10V  [CAPC3528-STAR]
C1_5V0  47uF 10V  [CAPC3528-STAR]
C2_3V3  0.1uF 16V  [CAPC1005-STAR]
C2_5V0  0.1uF 16V  [CAPC1005-STAR]
C3_3V3  0.1uF 16V  [CAPC1005-STAR]
C3_5V0  0.1uF 16V  [CAPC1005-STAR]
C4_3V3  0.1uF 16V  [CAPC1005-STAR]
C4_5V0  0.1uF 16V  [CAPC1005-STAR]
C5_3V3  0.1uF 16V  [CAPC1005-STAR]
C5_5V0  0.1uF 16V  [CAPC1005-STAR]
C6_3V3  0.1uF 16V  [CAPC1005-STAR]
C6_5V0  0.1uF 16V  [CAPC1005-STAR]

### Nets
3V3: C1_3V3.1 C2_3V3.2 C3_3V3.1 C4_3V3.2 C5_3V3.2 C6_3V3.1
5V0: C1_5V0.1 C2_5V0.2 C3_5V0.1 C4_5V0.2 C5_5V0.2 C6_5V0.1
GND: C1_3V3.2 C1_5V0.2 C2_3V3.1 C2_5V0.1 C3_3V3.2 C3_5V0.2 C4_3V3.1 C4_5V0.1 C5_3V3.1 C5_5V0.1 C6_3V3.2 C6_5V0.2

### Notes on the sheet
- Sheet Title
- Project Title
- Size:
- Date:
- A4
- Assy:
- Time:
- Revision:
- Sheet
- of
- File:

### Library data of the parts
C1_3V3 C1_5V0 = D-101-0001: as C1_CP on sheet MCU; Category: Capacitor; Capacitance: 47 uF; Mounting Technology: Surface Mount; Rated Voltage: 10 V; Status: Deprecated; Technology: Tantalum; Tolerance: 20 %
C2_3V3 C2_5V0 C3_3V3 C3_5V0 C4_3V3 C4_5V0 C5_3V3 C5_5V0 C6_3V3 C6_5V0 = D-101-0080: as C13 on sheet IO_Bus_Switch; Category: Capacitor; Capacitance: 0.1 uF; Dielectric: X7R; Mounting Technology: Surface Mount; Rated Voltage: 16 V; Status: Production; Technology: Ceramic; Tolerance: 10 %

## Sheet SD_Card_Socket.SchDoc: SD Card Socket
size A4; DocumentNumber: 11; SheetNumber: 11; SheetTotal: 12
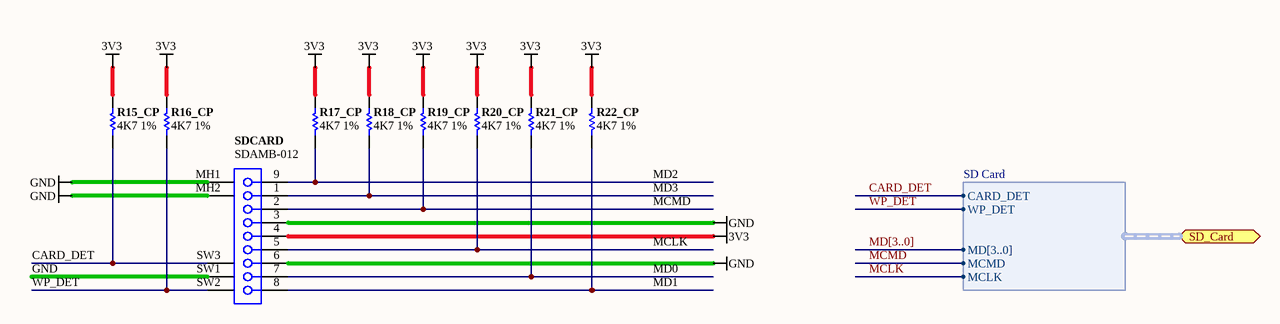
[diagram p9: SD_Card_Socket.SchDoc]

### Parts
R15_CP  4K7 1%  [RESC1005-STAR]
R16_CP  4K7 1%  [RESC1005-STAR]
R17_CP  4K7 1%  [RESC1005-STAR]
R18_CP  4K7 1%  [RESC1005-STAR]
R19_CP  4K7 1%  [RESC1005-STAR]
R20_CP  4K7 1%  [RESC1005-STAR]
R21_CP  4K7 1%  [RESC1005-STAR]
R22_CP  4K7 1%  [RESC1005-STAR]
SDCARD  SDAMB-012  [SDAMB-012]

### Ports
SD_Card (harness SD Card)

### Harnesses
SD Card: CARD_DET, WP_DET, MD[3..0], MCLK, MCMD

### Nets
3V3: R15_CP.2 R16_CP.2 R17_CP.2 R18_CP.2 R19_CP.2 R20_CP.2 R21_CP.2 R22_CP.2 SDCARD.4
GND: SDCARD.3 SDCARD.6 SDCARD.MH1 SDCARD.MH2 SDCARD.SW1
CARD_DET: R15_CP.1 SDCARD.SW3 ; port SD_Card.CARD_DET
MCLK: R20_CP.1 SDCARD.5 ; port SD_Card.MCLK
MCMD: R19_CP.1 SDCARD.2 ; port SD_Card.MCMD
MD0: R21_CP.1 SDCARD.7
MD1: R22_CP.1 SDCARD.8
MD2: R17_CP.1 SDCARD.9
MD3: R18_CP.1 SDCARD.1
WP_DET: R16_CP.1 SDCARD.SW2 ; port SD_Card.WP_DET

### Buses and harness runs
bus MD[3..0]

### Notes on the sheet
- Sheet Title
- Project Title
- Size:
- Date:
- A4
- Assy:
- Time:
- Revision:
- Sheet
- of
- File:

### Library data of the parts
R15_CP R16_CP R17_CP R18_CP R19_CP R20_CP R21_CP R22_CP = D-100-0088: as R1_CP on sheet MCU; Category: Resistor; Mounting Technology: Surface Mount; Status: Production; Tolerance: 1 %
SDCARD = D-300-0018: SDCARD Connector SDAMB-012; Connector type: Straight; Max Current: mA; Mounting Technology: Surface Mount; Status: Unreleased; Category: Connector

## Sheet Visual_Indicators.SchDoc: Visual Indicators
size A4; DocumentNumber: 12; SheetNumber: 12; SheetTotal: 12
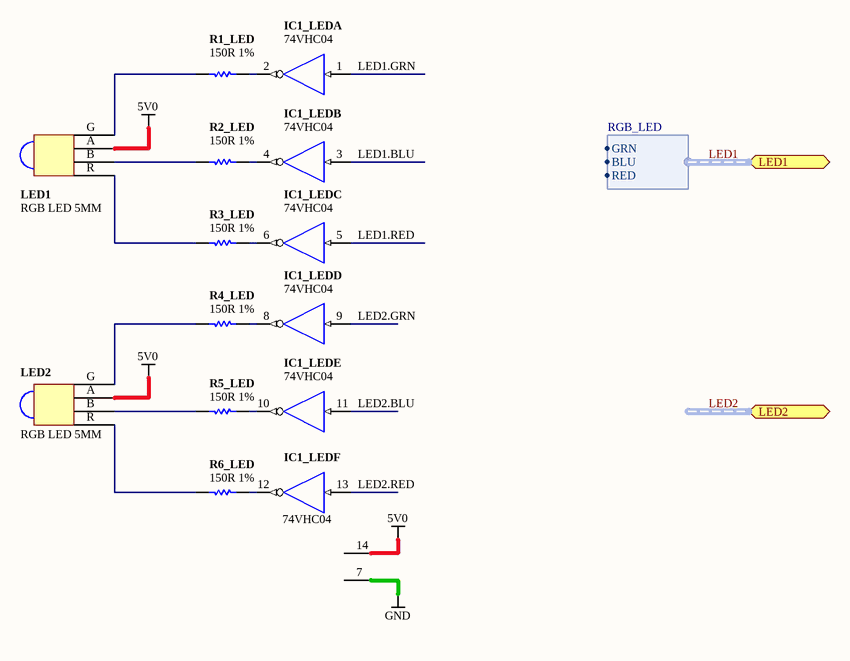
[diagram p10: Visual_Indicators.SchDoc]

### Parts
IC1_LED  74VHC04  [TSSOP14]  (parts A,B,C,D,E,F of 6)
LED1  RGB LED 5MM  [LED-RGB-5MM-RA]
LED2  RGB LED 5MM  [LED-RGB-5MM-RA]
R1_LED  150R 1%  [RESC1005-STAR]
R2_LED  150R 1%  [RESC1005-STAR]
R3_LED  150R 1%  [RESC1005-STAR]
R4_LED  150R 1%  [RESC1005-STAR]
R5_LED  150R 1%  [RESC1005-STAR]
R6_LED  150R 1%  [RESC1005-STAR]

### Ports
LED1 (harness RGB_LED), LED2 (harness RGB_LED)

### Harnesses
RGB_LED: GRN, BLU, RED

### Nets
5V0: IC1_LED.14(VCC) LED1.A LED2.A
GND: IC1_LED.7(GND)
LED1.BLU: IC1_LED.3(A)
LED1.GRN: IC1_LED.1(A)
LED1.RED: IC1_LED.5(A)
LED2.BLU: IC1_LED.11(A)
LED2.GRN: IC1_LED.9(A)
LED2.RED: IC1_LED.13(A)
NetIC1_LED_2: IC1_LED.2(Y) R1_LED.2
NetIC1_LED_4: IC1_LED.4(Y) R2_LED.2
NetIC1_LED_6: IC1_LED.6(Y) R3_LED.2
NetIC1_LED_8: IC1_LED.8(Y) R4_LED.2
NetIC1_LED_10: IC1_LED.10(Y) R5_LED.2
NetIC1_LED_12: IC1_LED.12(Y) R6_LED.2
NetLED1_B: LED1.B R2_LED.1
NetLED1_G: LED1.G R1_LED.1
NetLED1_R: LED1.R R3_LED.1
NetLED2_B: LED2.B R5_LED.1
NetLED2_G: LED2.G R4_LED.1
NetLED2_R: LED2.R R6_LED.1

### Buses and harness runs
harness LED1 = port LED1
harness LED2 = port LED2

### Notes on the sheet
- Sheet Title
- Project Title
- Size:
- Date:
- A4
- Assy:
- Time:
- Revision:
- Sheet
- of
- File:

### Library data of the parts
IC1_LED = D-205-0004: HEX Inverter; Mounting Technology: Surface Mount; Status: Unreleased; Category: IC-Logic
LED1 LED2 = D-153-0001: LED, RGB, 5mm, 540R2GBC-CA, Common Anode; Brightness: 1500 mcd; Peak Wave Length: nm; Color: RGB; Mounting Technology: Through-Hole; Status: Production; Category: LED
R1_LED R2_LED R3_LED R4_LED R5_LED R6_LED = D-100-0005: as R1 on sheet Hard_Soft_JTAG_Socket; Category: Resistor; Mounting Technology: Surface Mount; Resistance: 150 R; Status: Unreleased; Tolerance: 1 %

## Sheet MCU_Debug.SchDoc: Local MCU Debug Connector
size A4; DocumentNumber: 7; SheetNumber: 7; SheetTotal: 12
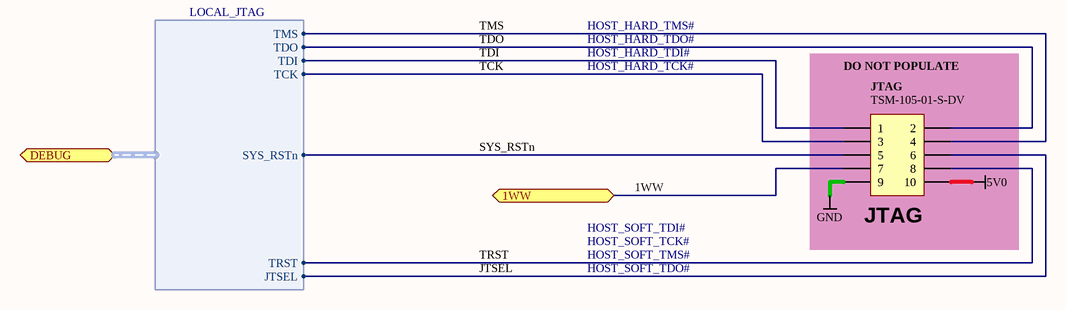
[diagram p11: MCU_Debug.SchDoc]

### Parts
JTAG  TSM-105-01-S-DV  [TSM-105-01-DV]  (no BOM)

### Blocks framed on the sheet
JTAG: JTAG

### Ports
1WW (bidir), DEBUG (harness LOCAL_JTAG)

### Harnesses
LOCAL_JTAG: TMS, TDO, TDI, TCK, SYS_RSTn, TRST, JTSEL

### Nets
5V0: JTAG.10
GND: JTAG.9
1WW: JTAG.7 ; port 1WW
JTSEL: JTAG.6 ; port DEBUG.JTSEL
SYS_RSTn: JTAG.5 ; port DEBUG.SYS_RSTn
TCK: JTAG.3 ; port DEBUG.TCK
TDI: JTAG.1 ; port DEBUG.TDI
TDO: JTAG.2 ; port DEBUG.TDO
TMS: JTAG.4 ; port DEBUG.TMS
TRST: JTAG.8 ; port DEBUG.TRST

### Notes on the sheet
- HOST_HARD_TMS#
- HOST_HARD_TDO#
- HOST_HARD_TDI#
- HOST_HARD_TCK#
- DO NOT POPULATE
- HOST_SOFT_TDI#
- HOST_SOFT_TCK#
- HOST_SOFT_TMS#
- HOST_SOFT_TDO#
- Sheet Title
- Project Title
- Size:
- Date:
- A4
- Assy:
- Time:
- Revision:
- Sheet
- of
- File:

### Library data of the parts
JTAG = D-300-0076: Non-Boxed Header IDC, 2 X 5 Pin SMD; Connector type: Boxed; Max Current: mA; Category: Connector; Mounting Technology: Surface Mount; Status: Unreleased

## Nets that join several sheets
3V3: MCU (28 pins), DT01_ID (IC1_ID.4 R1_ID.2), IO_Bus_Switch (R25_CP.2 R26_CP.2), Mini_USB_Socket (R1_US.2), Power_Bypass_Caps (6 pins), SD_Card_Socket (9 pins)
5V0: MCU (IC1_CP.T18), Hard_Soft_JTAG_Socket (R1.1), IO_Bus_Switch (D1.1 D1.2), Mini_USB_Socket (CN1_US.1 R2_US.2), One-Wire_Write_Read (5 pins), Power_Bypass_Caps (6 pins), Visual_Indicators (IC1_LED.14 LED1.A LED2.A), MCU_Debug (JTAG.10)
GND: MCU (35 pins), DT01_ID (D1_ID.1 IC1_ID.1), Hard_Soft_JTAG_Socket (9 pins), IO_Bus_Switch (C13.2 IC2.10 R10.2 R27.1), Mini_USB_Socket (8 pins), One-Wire_Write_Read (8 pins), Power_Bypass_Caps (12 pins), SD_Card_Socket (5 pins), Visual_Indicators (IC1_LED.7), MCU_Debug (JTAG.9)
1WB: MCU (IC1_CP.C4), One-Wire_Write_Read (R1_1WB.1)
1WB+WR: Hard_Soft_JTAG_Socket (CN1.14), One-Wire_Write_Read (CN2.5)
1WB_12V_tPP: MCU (IC1_CP.C5), One-Wire_Write_Read (R2_1WB.1)
1WW: DT01_ID (IC1_ID.2 R2_ID.2), MCU_Debug (JTAG.7)
CARD_DET: MCU (IC1_CP.K3), SD_Card_Socket (R15_CP.1 SDCARD.SW3)
D+: MCU (IC1_CP.U17), Mini_USB_Socket (CN1_US.3 R1_US.1)
D-: MCU (IC1_CP.T17), Mini_USB_Socket (CN1_US.2)
JTSEL: MCU (IC1_CP.U4), MCU_Debug (JTAG.6)
MCLK: MCU (IC1_CP.G3), SD_Card_Socket (R20_CP.1 SDCARD.5)
MCMD: MCU (IC1_CP.H2), SD_Card_Socket (R19_CP.1 SDCARD.2)
MD0: MCU (IC1_CP.H3), SD_Card_Socket (R21_CP.1 SDCARD.7)
MD1: MCU (IC1_CP.J2), SD_Card_Socket (R22_CP.1 SDCARD.8)
MD2: MCU (IC1_CP.J1), SD_Card_Socket (R17_CP.1 SDCARD.9)
MD3: MCU (IC1_CP.J3), SD_Card_Socket (R18_CP.1 SDCARD.1)
PROD_ID: MCU (IC1_CP.B1), DT01_ID (D1_ID.2 R1_ID.1 R2_ID.1)
RESETn: MCU (IC1_CP.T14 IC2_CP.2 R23_CP.1), IO_Bus_Switch (IC2.1)
SYS_RSTn: MCU (IC2_CP.3 R1_CP.1), MCU_Debug (JTAG.5)
TCK: MCU (IC1_CP.V4 R12_CP.1), MCU_Debug (JTAG.3)
TDI: MCU (IC1_CP.T5 R11_CP.1), MCU_Debug (JTAG.1)
TDO: MCU (IC1_CP.U13 R10_CP.1), MCU_Debug (JTAG.2)
TMS: MCU (IC1_CP.U12 R9_CP.1), MCU_Debug (JTAG.4)
TRST: MCU (IC1_CP.T13 R8_CP.1), MCU_Debug (JTAG.8)
VPP_ON: Hard_Soft_JTAG_Socket (CN1.15), One-Wire_Write_Read (CN2.4 IC1_12V.4 R3_12V.2)
VUSB: MCU (IC1_CP.U14), Mini_USB_Socket (C1_US.2 R2_US.1 R3_US.1)
WP_DET: MCU (IC1_CP.L3), SD_Card_Socket (R16_CP.1 SDCARD.SW2)